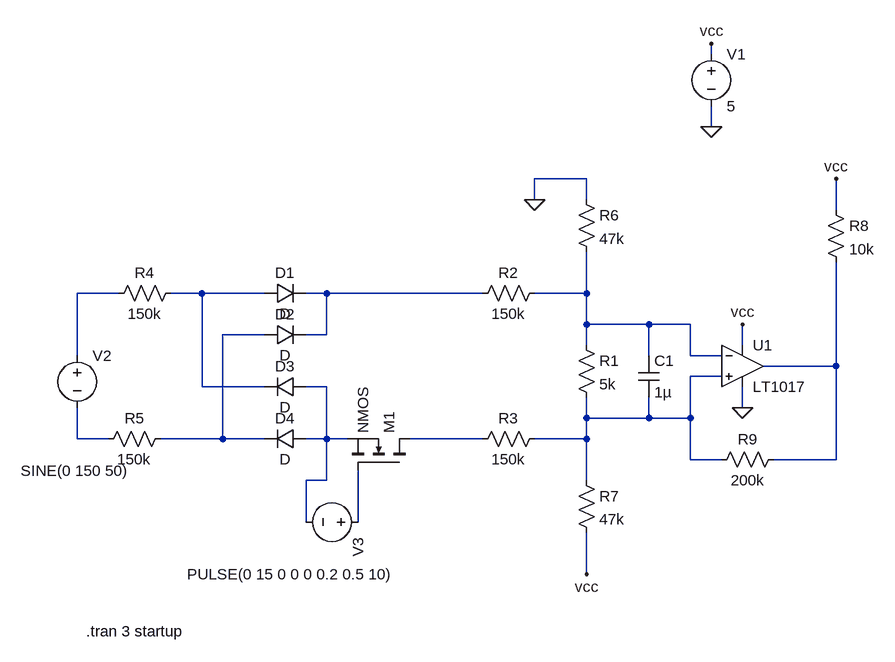
[diagram p0: schematic detector 220v.asc]
detector 220v.asc, the LTspice schematic file:
Version 4
SHEET 1 880 680
WIRE 144 -320 144 -336
WIRE 144 -208 144 -240
WIRE -48 -128 -128 -128
WIRE -128 -96 -128 -128
WIRE -48 -96 -48 -128
WIRE 336 -80 336 -128
WIRE -768 48 -832 48
WIRE -640 48 -688 48
WIRE -544 48 -640 48
WIRE -448 48 -480 48
WIRE -208 48 -448 48
WIRE -48 48 -48 -16
WIRE -48 48 -128 48
WIRE -48 96 -48 48
WIRE 48 96 -48 96
WIRE 112 96 48 96
WIRE -544 112 -608 112
WIRE -448 112 -448 48
WIRE -448 112 -480 112
WIRE -48 128 -48 96
WIRE 192 128 192 96
WIRE -832 144 -832 48
WIRE 48 144 48 96
WIRE 112 144 112 96
WIRE 160 144 112 144
WIRE 336 160 336 0
WIRE 336 160 224 160
WIRE 160 176 112 176
WIRE -640 192 -640 48
WIRE -544 192 -640 192
WIRE -448 192 -480 192
WIRE 192 224 192 192
WIRE -48 240 -48 208
WIRE 48 240 48 208
WIRE 48 240 -48 240
WIRE 112 240 112 176
WIRE 112 240 48 240
WIRE -832 272 -832 224
WIRE -784 272 -832 272
WIRE -608 272 -608 112
WIRE -608 272 -704 272
WIRE -544 272 -608 272
WIRE -448 272 -448 192
WIRE -448 272 -480 272
WIRE -416 272 -448 272
WIRE -208 272 -320 272
WIRE -48 272 -48 240
WIRE -48 272 -128 272
WIRE 112 304 112 240
WIRE 160 304 112 304
WIRE 336 304 336 160
WIRE 336 304 240 304
WIRE -448 336 -448 272
WIRE -448 336 -480 336
WIRE -48 336 -48 272
WIRE -480 400 -480 336
WIRE -400 400 -400 320
WIRE -48 480 -48 416
FLAG 144 -208 0
FLAG 144 -336 vcc
FLAG 192 96 vcc
FLAG 192 224 0
FLAG -128 -96 0
FLAG -48 480 vcc
FLAG 336 -128 vcc
SYMBOL Comparators\\LT1017 192 160 R0
SYMATTR InstName U1
SYMBOL voltage 144 -336 R0
WINDOW 123 0 0 Left 0
WINDOW 39 0 0 Left 0
SYMATTR InstName V1
SYMATTR Value 5
SYMBOL res -64 112 R0
SYMATTR InstName R1
SYMATTR Value 5k
SYMBOL res -112 32 R90
WINDOW 0 0 56 VBottom 2
WINDOW 3 32 56 VTop 2
SYMATTR InstName R2
SYMATTR Value 150k
SYMBOL res -112 256 R90
WINDOW 0 0 56 VBottom 2
WINDOW 3 32 56 VTop 2
SYMATTR InstName R3
SYMATTR Value 150k
SYMBOL res -672 32 R90
WINDOW 0 0 56 VBottom 2
WINDOW 3 32 56 VTop 2
SYMATTR InstName R4
SYMATTR Value 150k
SYMBOL res -688 256 R90
WINDOW 0 0 56 VBottom 2
WINDOW 3 32 56 VTop 2
SYMATTR InstName R5
SYMATTR Value 150k
SYMBOL diode -544 64 R270
WINDOW 0 32 32 VTop 2
WINDOW 3 0 32 VBottom 2
SYMATTR InstName D1
SYMBOL diode -544 128 R270
WINDOW 0 32 32 VTop 2
WINDOW 3 0 32 VBottom 2
SYMATTR InstName D2
SYMBOL diode -480 176 R90
WINDOW 0 0 32 VBottom 2
WINDOW 3 32 32 VTop 2
SYMATTR InstName D3
SYMBOL diode -480 256 R90
WINDOW 0 0 32 VBottom 2
WINDOW 3 32 32 VTop 2
SYMATTR InstName D4
SYMBOL res -64 -112 R0
SYMATTR InstName R6
SYMATTR Value 47k
SYMBOL res -64 320 R0
SYMATTR InstName R7
SYMATTR Value 47k
SYMBOL voltage -832 128 R0
WINDOW 3 -87 193 Left 2
WINDOW 123 0 0 Left 0
WINDOW 39 0 0 Left 0
SYMATTR InstName V2
SYMATTR Value SINE(0 150 50)
SYMBOL res 320 -96 R0
SYMATTR InstName R8
SYMATTR Value 10k
SYMBOL cap 32 144 R0
SYMATTR InstName C1
SYMATTR Value 1µ
SYMBOL voltage -384 400 R90
WINDOW 3 80 -38 VRight 2
WINDOW 123 0 0 Left 0
WINDOW 39 0 0 Left 0
SYMATTR InstName V3
SYMATTR Value PULSE(0 15 0 0 0 0.2 0.5 10)
SYMBOL nmos -320 320 M270
SYMATTR InstName M1
SYMBOL res 256 288 R90
WINDOW 0 0 56 VBottom 2
WINDOW 3 32 56 VTop 2
SYMATTR InstName R9
SYMATTR Value 200k
TEXT -818 568 Left 2 !.tran 3 startup

The netlist it stands for:
* detector 220v.asc
XU1 N007 N004 vcc 0 N006 LT1017  ; pins In+ In- V+ V- OUT
V1 vcc 0 5
R1 N004 N007 5k
R2 N004 N003 150k
R3 N007 N010 150k
R4 N002 N001 150k
R5 N005 N009 150k
D1 N002 N003 D
D2 N005 N003 D
D3 N008 N002 D
D4 N008 N005 D
R6 0 N004 47k
R7 N007 vcc 47k
V2 N001 N009 SINE(0 150 50)
R8 vcc N006 10k
C1 N004 N007 1µ
V3 N011 N008 PULSE(0 15 0 0 0 0.2 0.5 10)
M1 N010 N011 N008 N008 NMOS
R9 N006 N007 200k
.model D D
.lib standard.dio
.model NMOS NMOS
.model PMOS PMOS
.lib standard.mos
.tran 3 startup
.backanno
.end